# EAGLE design Mainboard (EAGLE 9.6.2)
CNAME: Yvan Satyawan; CREVISION: 2.0
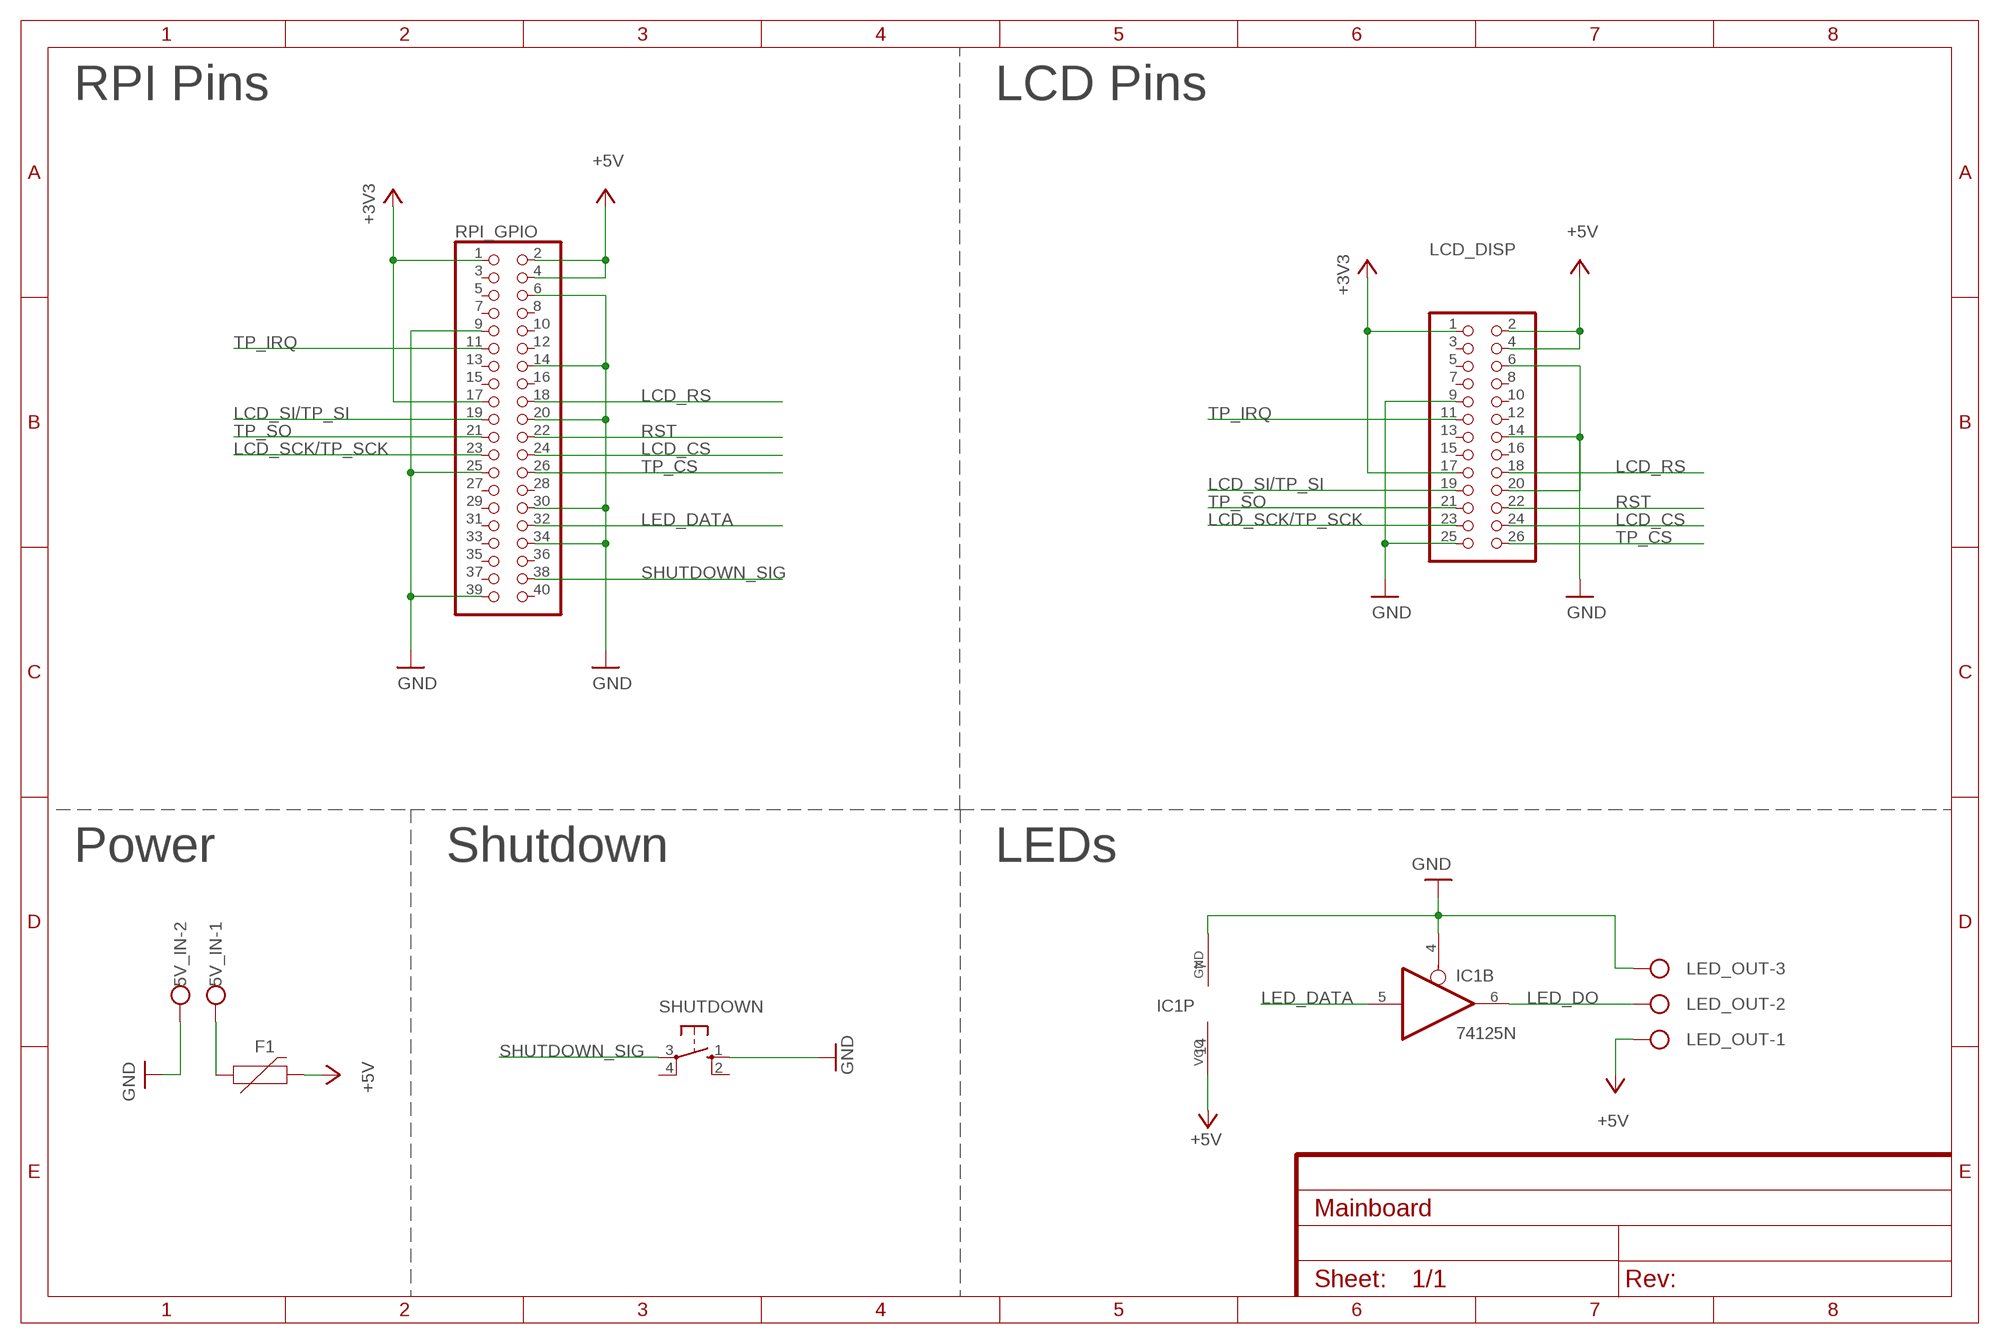
[diagram p0: schematic, sheet 1]

## Parts
5V_IN  W237-102  [W237-102]
F1  JK30-500  [JK30-500]
IC1  74125N  [DIL14]
LCD_DISP  PINHD-2X13  [2X13]
LED_OUT  W237-103  [W237-103]
RPI_GPIO  PINHD-2X20  [2X20]
SHUTDOWN  40-XX  [B3F-40XX]

## Nets
+3V3: LCD_DISP.1 LCD_DISP.17 RPI_GPIO.1 RPI_GPIO.17
+5V: F1.P$2 IC1.14(P:VCC) LCD_DISP.2 LCD_DISP.4 LED_OUT.1 RPI_GPIO.2 RPI_GPIO.4
GND: 5V_IN.2 IC1.4(B:OE) IC1.7(P:GND) LCD_DISP.6 LCD_DISP.9 LCD_DISP.14 LCD_DISP.20 LCD_DISP.25 LED_OUT.3 RPI_GPIO.6 RPI_GPIO.9 RPI_GPIO.14 RPI_GPIO.20 RPI_GPIO.25 RPI_GPIO.30 RPI_GPIO.34 RPI_GPIO.39 SHUTDOWN.1(S)
LCD_CS: LCD_DISP.24 RPI_GPIO.24
LCD_RS: LCD_DISP.18 RPI_GPIO.18
LCD_SCK/TP_SCK: LCD_DISP.23 RPI_GPIO.23
LCD_SI/TP_SI: LCD_DISP.19 RPI_GPIO.19
LED_DATA: IC1.5(B:I) RPI_GPIO.32
LED_DO: IC1.6(B:O) LED_OUT.2
N$1: 5V_IN.1 F1.P$1
RST: LCD_DISP.22 RPI_GPIO.22
SHUTDOWN_SIG: RPI_GPIO.38 SHUTDOWN.3(P)
TP_CS: LCD_DISP.26 RPI_GPIO.26
TP_IRQ: LCD_DISP.11 RPI_GPIO.11
TP_SO: LCD_DISP.21 RPI_GPIO.21
Unconnected: IC1.1(A:OE) IC1.2(A:I) IC1.3(A:O) IC1.8(C:O) IC1.9(C:I) IC1.10(C:OE) IC1.11(D:O) IC1.12(D:I) IC1.13(D:OE) LCD_DISP.3 LCD_DISP.5 LCD_DISP.7 LCD_DISP.8 LCD_DISP.10 LCD_DISP.12 LCD_DISP.13 LCD_DISP.15 LCD_DISP.16 RPI_GPIO.3 RPI_GPIO.5 RPI_GPIO.7 RPI_GPIO.8 RPI_GPIO.10 RPI_GPIO.12 RPI_GPIO.13 RPI_GPIO.15 RPI_GPIO.16 RPI_GPIO.27 RPI_GPIO.28 RPI_GPIO.29 RPI_GPIO.31 RPI_GPIO.33 RPI_GPIO.35 RPI_GPIO.36 RPI_GPIO.37 RPI_GPIO.40 SHUTDOWN.2(S1) SHUTDOWN.4(P1)

## Notes on the sheet
- RPI Pins | LCD Pins
- Power | Shutdown | LEDs

## Library data of the parts
5V_IN = con-wago-500:W237-102: WAGO SCREW CLAMP; MPN: 237-102; OC_FARNELL: unknown; OC_NEWARK: 70K9898
F1 = Custom Parts:JK30-500: JK30-500 Resettable Polymer PTC Fuse
IC1 = 74xx-us:74*125: Quad bus BUFFER, 3-state
LCD_DISP = pinhead:PINHD-2X13: PIN HEADER; SPICEPREFIX: X
LED_OUT = con-wago-500:W237-103: WAGO SCREW CLAMP; MPN: 237-103; OC_FARNELL: unknown; OC_NEWARK: 18M7116
RPI_GPIO = pinhead:PINHD-2X20: PIN HEADER
SHUTDOWN = switch-omron:40-XX: OMRON SWITCH; MF: OMRON COMPONENTS USA; MPN: B3F-4000; OC_FARNELL: 176434; OC_NEWARK: 36K3105

## Net classes
0 default: width 0.2 mm, clearance 0.8 mm

## Board
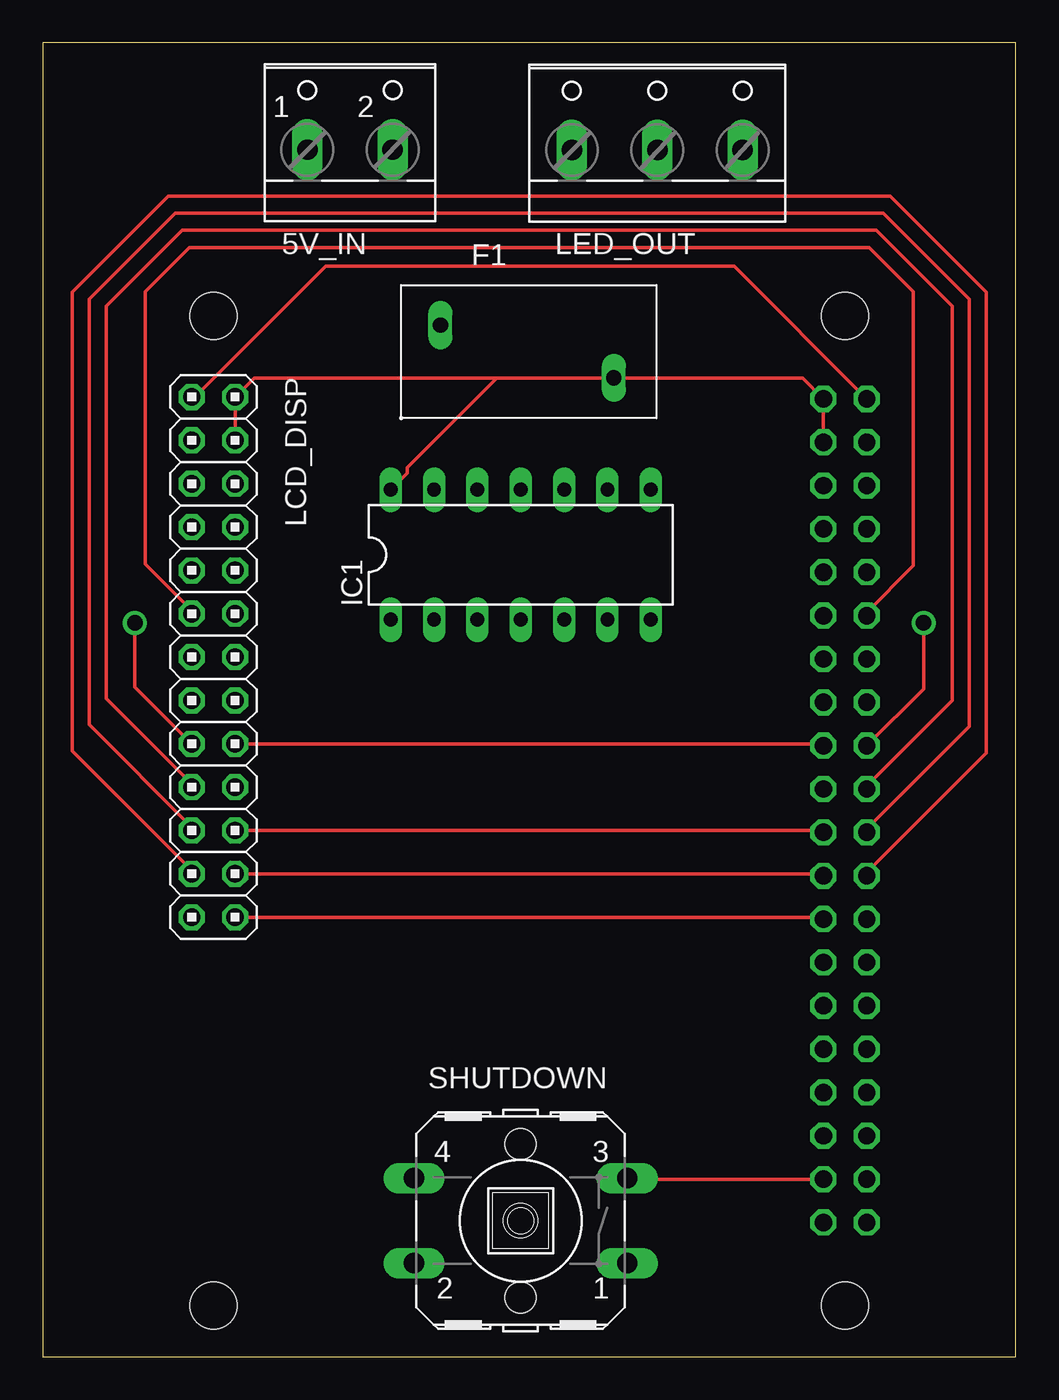
[diagram p1: board, top side]
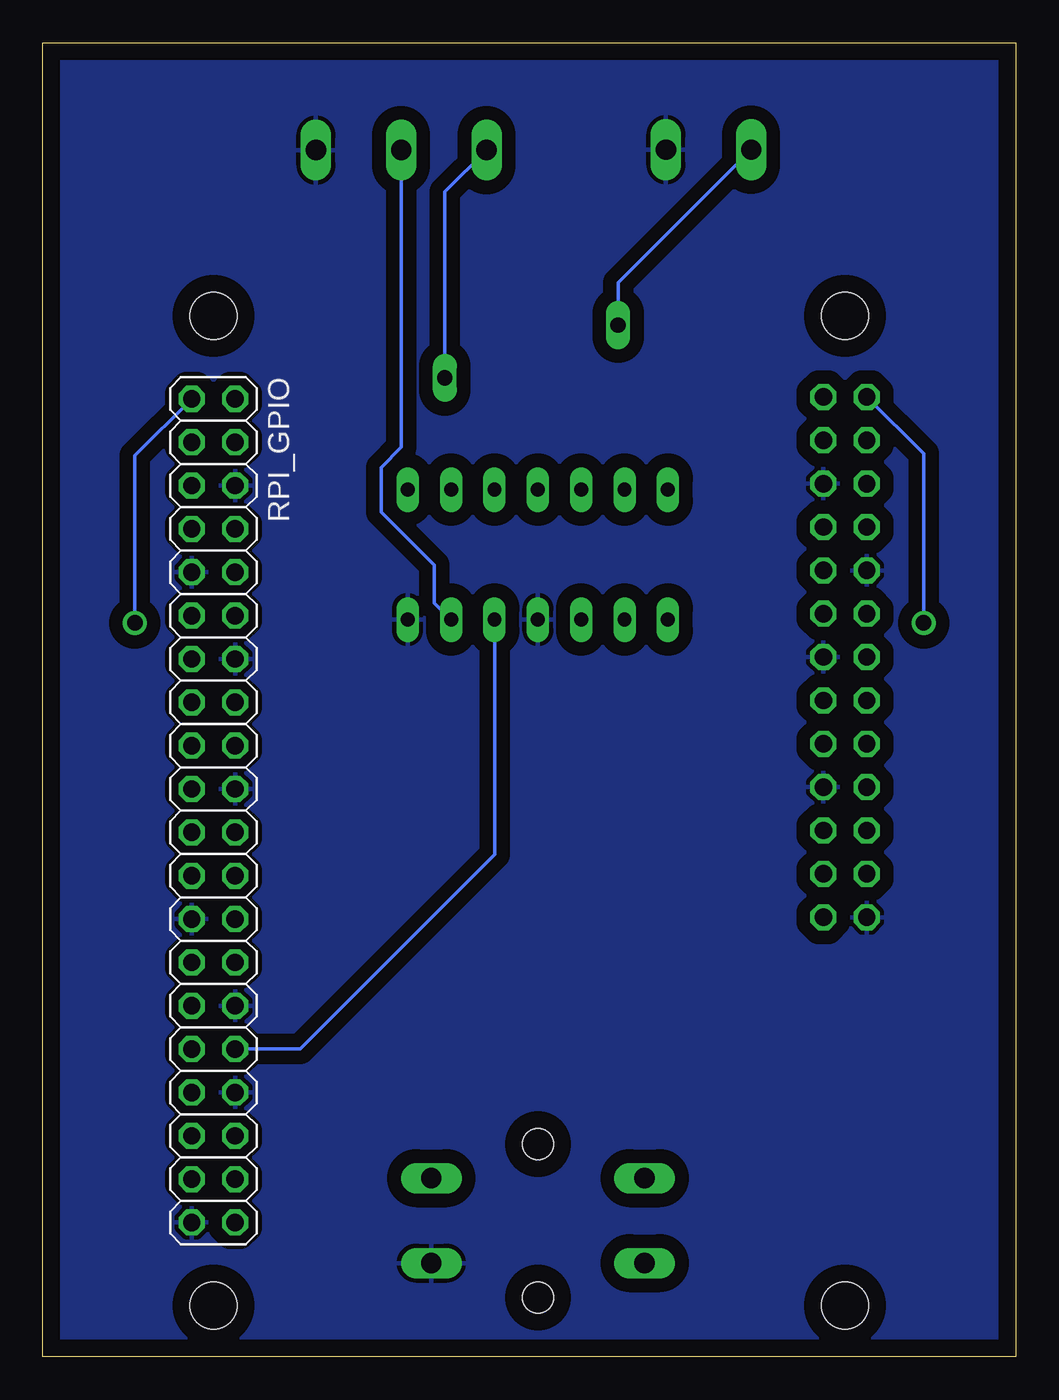
[diagram p2: board, bottom side, seen from below]

Size 57 x 77 mm. Coordinates in mm from the lower left corner, seen from the top.
Outline: 0,0 57,0 57,77 0,77 0,0
Copper layers (1*16): Top 0.035mm / dielectric 1.5mm / Bottom 0.035mm
Design rules "default *": minimum track width 0.1mm, minimum drill 0.9mm, track to track 0.8mm, track to pad 0.8mm, pad to pad 0.8mm, via to via 0.8mm, smd to smd 6mil, copper to edge 40mil, drill to drill 6mil, minimum pad ring 10mil, minimum via ring 8mil, stop-mask expansion 4mil, vias tented up to drill 0mil, thermal gap 10mil
Holes 2.75 mm at 47,3 47,61 10,61 10,3

### Footprints (pad centres in the part's own frame; a part is rotated, then mirrored left to right if it is on the bottom)
W237-102 = drill 1.194 long: 1 -2.5,-1.27; 2 2.5,-1.27
JK30-500 = drill 0.9 long: P$1 2.3,5.45; P$2 12.45,2.35
DIL14 = drill 0.813 long: 1 -7.62,-3.81; 2 -5.08,-3.81; 3 -2.54,-3.81; 4 0,-3.81; 5 2.54,-3.81; 6 5.08,-3.81; 7 7.62,-3.81; 8 7.62,3.81; 9 5.08,3.81; 10 2.54,3.81; 11 0,3.81; 12 -2.54,3.81; 13 -5.08,3.81; 14 -7.62,3.81
2X13 = drill 1.016 octagon: 1 -15.24,-1.27; 2 -15.24,1.27; 3 -12.7,-1.27; 4 -12.7,1.27; 5 -10.16,-1.27; 6 -10.16,1.27; 7 -7.62,-1.27; 8 -7.62,1.27; 9 -5.08,-1.27; 10 -5.08,1.27; 11 -2.54,-1.27; 12 -2.54,1.27; 13 0,-1.27; 14 0,1.27; 15 2.54,-1.27; 16 2.54,1.27; 17 5.08,-1.27; 18 5.08,1.27; 19 7.62,-1.27; 20 7.62,1.27; 21 10.16,-1.27; 22 10.16,1.27; 23 12.7,-1.27; 24 12.7,1.27; 25 15.24,-1.27; 26 15.24,1.27
W237-103 = drill 1.194 long: 1 -5,-1.29; 2 0,-1.29; 3 5,-1.29
2X20 = drill 1.016 octagon: 1 -24.13,-1.27; 2 -24.13,1.27; 3 -21.59,-1.27; 4 -21.59,1.27; 5 -19.05,-1.27; 6 -19.05,1.27; 7 -16.51,-1.27; 8 -16.51,1.27; 9 -13.97,-1.27; 10 -13.97,1.27; 11 -11.43,-1.27; 12 -11.43,1.27; 13 -8.89,-1.27; 14 -8.89,1.27; 15 -6.35,-1.27; 16 -6.35,1.27; 17 -3.81,-1.27; 18 -3.81,1.27; 19 -1.27,-1.27; 20 -1.27,1.27; 21 1.27,-1.27; 22 1.27,1.27; 23 3.81,-1.27; 24 3.81,1.27; 25 6.35,-1.27; 26 6.35,1.27; 27 8.89,-1.27; 28 8.89,1.27; 29 11.43,-1.27; 30 11.43,1.27; 31 13.97,-1.27; 32 13.97,1.27; 33 16.51,-1.27; 34 16.51,1.27; 35 19.05,-1.27; 36 19.05,1.27; 37 21.59,-1.27; 38 21.59,1.27; 39 24.13,-1.27; 40 24.13,1.27
B3F-40XX = drill 1.194 long: 1 -6.248,2.489; 2 6.248,2.489; 3 -6.248,-2.489; 4 6.248,-2.489 | hole 1.803: 0,-4.496; 0,4.496

### Placement (x,y rotation side)
5V_IN  18,72 0 top
F1  21,55 0 top
IC1  28,47 0 top
LCD_DISP  10,41 270 top
LED_OUT  36,72 0 top
RPI_GPIO  47,32 270 bottom
SHUTDOWN  27.99,7.98 180 top

### Tracks (layer width: path | path; a pad name or v marks a point on that pad's centre or on a via)
+3V3  (via drill 0.9 pad 1.4)
  Top 0.2: LCD_DISP.17 5.4,39.25 v5.4,43 | LCD_DISP.1 8.92,56.24 16.58,63.9 40.5,63.9 RPI_GPIO.1 | v51.6,43 51.6,39.14 RPI_GPIO.17
  Bottom 0.2: LCD_DISP.1 5.4,52.91 v5.4,43 | RPI_GPIO.1 51.6,52.8 v51.6,43
+5V
  Top 0.2: RPI_GPIO.4 RPI_GPIO.2 44.51,57.35 F1.P$2 27,57.35 26.59,57.35 | LCD_DISP.4 LCD_DISP.2 12.38,57.35 26.59,57.35 | IC1.14 21.36,51.79 21.36,52.12 26.59,57.35
  Bottom 0.2: LED_OUT.1 33.45,68.26 F1.P$2
GND
  pour Bottom: 0,0 57,0 57,77 0,77
LCD_CS
  Top 0.2: LCD_DISP.24 45.62,28.3 RPI_GPIO.24
LCD_RS
  Top 0.2: LCD_DISP.18 45.62,35.92 RPI_GPIO.18
LCD_SCK/TP_SCK
  Top 0.2: LCD_DISP.23 8.73,28.49 1.72,35.5 1.72,62.38 7.34,68 49.66,68 55.28,62.38 55.28,35.39 48.27,28.38 RPI_GPIO.23
LCD_SI/TP_SI
  Top 0.2: LCD_DISP.19 8.73,33.57 3.72,38.58 3.72,61.55 8.17,66 48.83,66 53.28,61.55 53.28,38.47 48.27,33.46 RPI_GPIO.19
LED_DATA
  Bottom 0.2: IC1.5 30.52,43.17 30.52,29.43 41.92,18.03 RPI_GPIO.32
LED_DO
  Bottom 0.2: IC1.6 34.06,44.17 34.06,46.38 37.18,49.5 37.18,52.12 36,53.3 LED_OUT.2
N$1
  Bottom 0.2: 5V_IN.1 23.3,62.93 F1.P$1
RST
  Top 0.2: LCD_DISP.22 45.62,30.84 RPI_GPIO.22
SHUTDOWN_SIG
  Top 0.2: SHUTDOWN.3 34.3,10.41 RPI_GPIO.38
TP_CS
  Top 0.2: LCD_DISP.26 45.62,25.76 RPI_GPIO.26
TP_IRQ
  Top 0.2: LCD_DISP.11 8.73,43.73 6,46.46 6,62.41 8.59,65 48.41,65 51,62.41 51,46.35 48.27,43.62 RPI_GPIO.11
TP_SO
  Top 0.2: LCD_DISP.21 8.73,31.03 2.72,37.04 2.72,61.96 7.76,67 49.24,67 54.28,61.96 54.28,36.93 48.27,30.92 RPI_GPIO.21